# EAGLE design GameController (EAGLE 9.4.2)

## Sheet 1 of 3
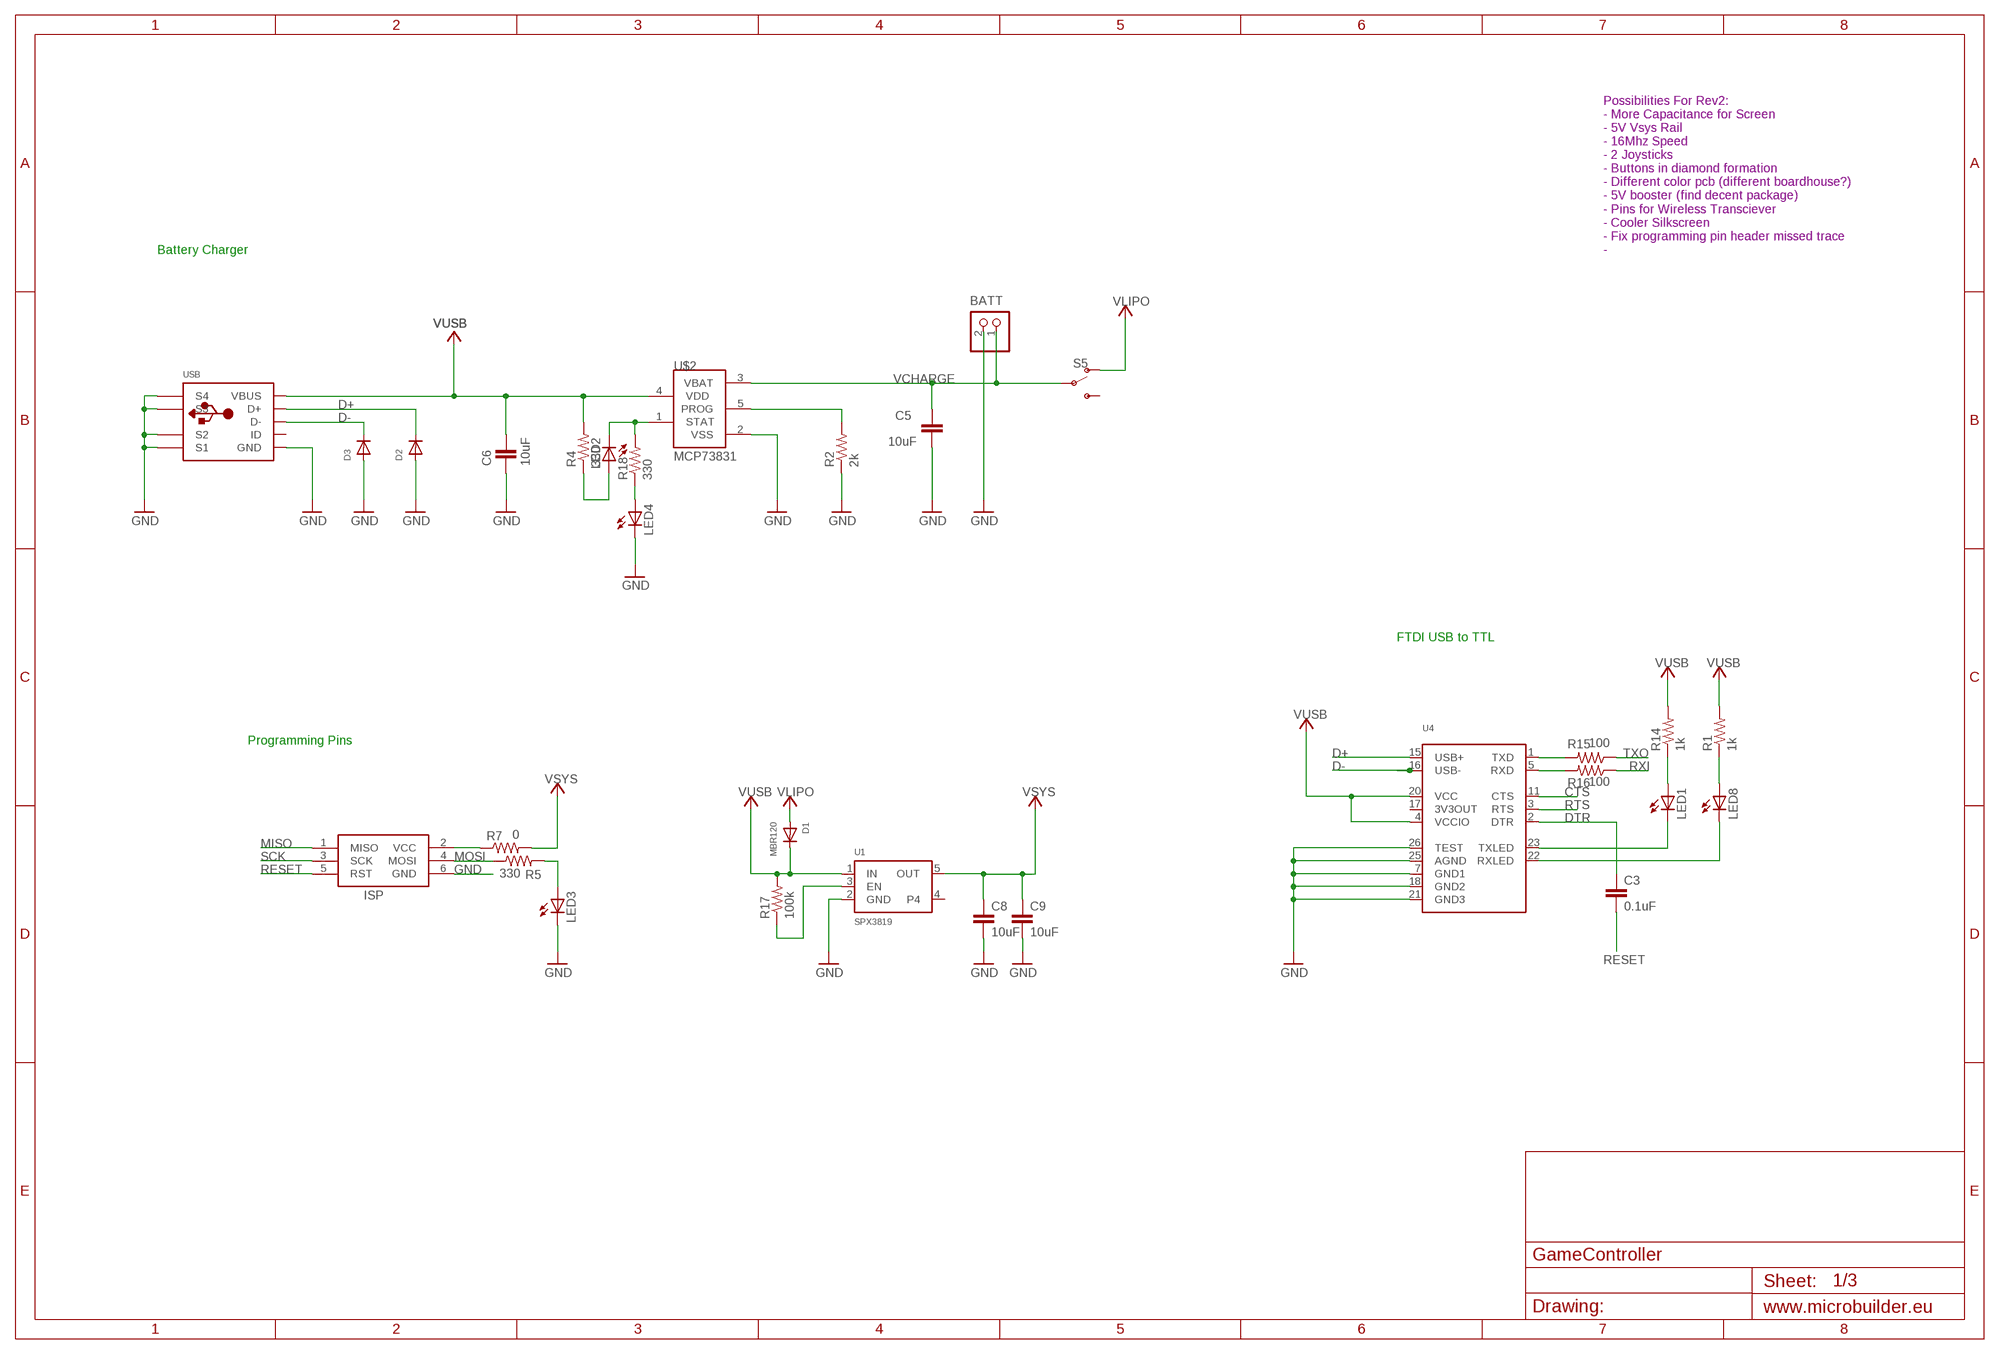
[diagram p0: schematic, sheet 1]

### Parts
BATT  JST_2PIN-SMT-RA  [JST-PH-2-SMT-RA]
C3  0.1uF  C-EUC0805  [C0805]
C5  10uF  C-EUC0805  [C0805]
C6  10uF  C-EUC0805  [C0805]
C8  10uF  C-EUC0805  [C0805]
C9  10uF  C-EUC0805  [C0805]
D1  MBR120  DIODESOD-123  [SOD-123]
D2  DIODESOD-323  [SOD-323]
D3  DIODESOD-323  [SOD-323]
ISP  AVRISP-6  [AVRISP]
LED1  LEDCHIPLED_0805  [CHIPLED_0805]
LED2  LEDCHIPLED_0805  [CHIPLED_0805]
LED3  LEDCHIPLED_0805  [CHIPLED_0805]
LED4  LEDCHIPLED_0805  [CHIPLED_0805]
LED8  LEDCHIPLED_0805  [CHIPLED_0805]
R1  1k  R-US_R0805  [R0805]
R2  2k  R-US_R0805  [R0805]
R4  330  R-US_R0805  [R0805]
R5  330  R-US_R0805  [R0805]
R7  0  R-US_R0805  [R0805]
R14  1k  R-US_R0805  [R0805]
R15  100  R-US_R0805  [R0805]
R16  100  R-US_R0805  [R0805]
R17  100k  R-US_R0805  [R0805]
R18  330  R-US_R0805  [R0805]
S5  SWITCH-SPDT-SMD-RIGHT-ANGLE  [SWITCH_SPST_SMD_A]
U1  SPX3819  VREG_SOT23-5  [SOT23-5]
U4  FT232RLSSOP28  [SSOP28DB]
U$2  MCP73831  [SOT23-5L]
USB  USBMINIB  [USB-MINIB]

### Nets
CTS: U4.11(CTS)
D+: D2.C U4.15(USB+) USB.D+
D-: D3.C U4.16(USB-) USB.D-
DTR: C3.1 U4.2(DTR)
GND: BATT.2 C5.2 C6.2 C8.2 C9.2 D2.A D3.A ISP.6(GND) LED3.C LED4.C R2.1 U1.2(GND) U4.7(GND1) U4.18(GND2) U4.21(GND3) U4.25(AGND) U4.26(TEST) U$2.2(VSS) USB.GND USB.GND1(S1) USB.GND2(S2) USB.GND3(S3) USB.GND4(S4) ; also sheet 2,3
MISO: ISP.1(MISO) ; also sheet 3
MOSI: ISP.4(MOSI) R5.1 ; also sheet 3
N$2: LED3.A R5.2
N$3: LED2.A R4.1
N$4: R15.2 U4.1(TXD)
N$6: LED2.C R18.2 U$2.1(STAT)
N$7: R2.2 U$2.5(PROG)
N$8: R16.2 U4.5(RXD)
N$10: ISP.2(VCC) R7.1
N$11: LED4.A R18.1
N$14: R17.1 U1.3(EN)
N$20: LED1.C U4.23(TXLED)
N$21: LED8.C U4.22(RXLED)
N$22: LED1.A R14.1
N$23: LED8.A R1.1
RESET: C3.2 ISP.5(RST) ; also sheet 3
RTS: U4.3(RTS)
RXI: R16.1 ; also sheet 3
SCK: ISP.3(SCK) ; also sheet 3
TXO: R15.1 ; also sheet 3
VCHARGE: BATT.1 C5.1 S5.2(P) U$2.3(VBAT)
VLIPO: D1.A S5.1(O) ; supply symbol labelled VCC
VSYS: C8.1 C9.1 R7.2 U1.5(OUT) ; supply symbol labelled VCC ; also sheet 2,3
VUSB: C6.1 D1.C R1.2 R4.2 R14.2 R17.2 U1.1(IN) U4.4(VCCIO) U4.20(VCC) U$2.4(VDD) USB.VBUS ; supply symbol labelled VCC
Unconnected: S5.3(S) U1.4 USB.ID

### Notes on the sheet
- Battery Charger
- Possibilities For Rev2:
  - More Capacitance for Screen
  - 5V Vsys Rail
  - 16Mhz Speed
  - 2 Joysticks
  - Buttons in diamond formation
  - Different color pcb (different boardhouse?)
  - 5V booster (find decent package)
  - Pins for Wireless Transciever
  - Cooler Silkscreen
  - Fix programming pin header missed trace
  -
- FTDI USB to TTL
- Programming Pins

## Sheet 2 of 3
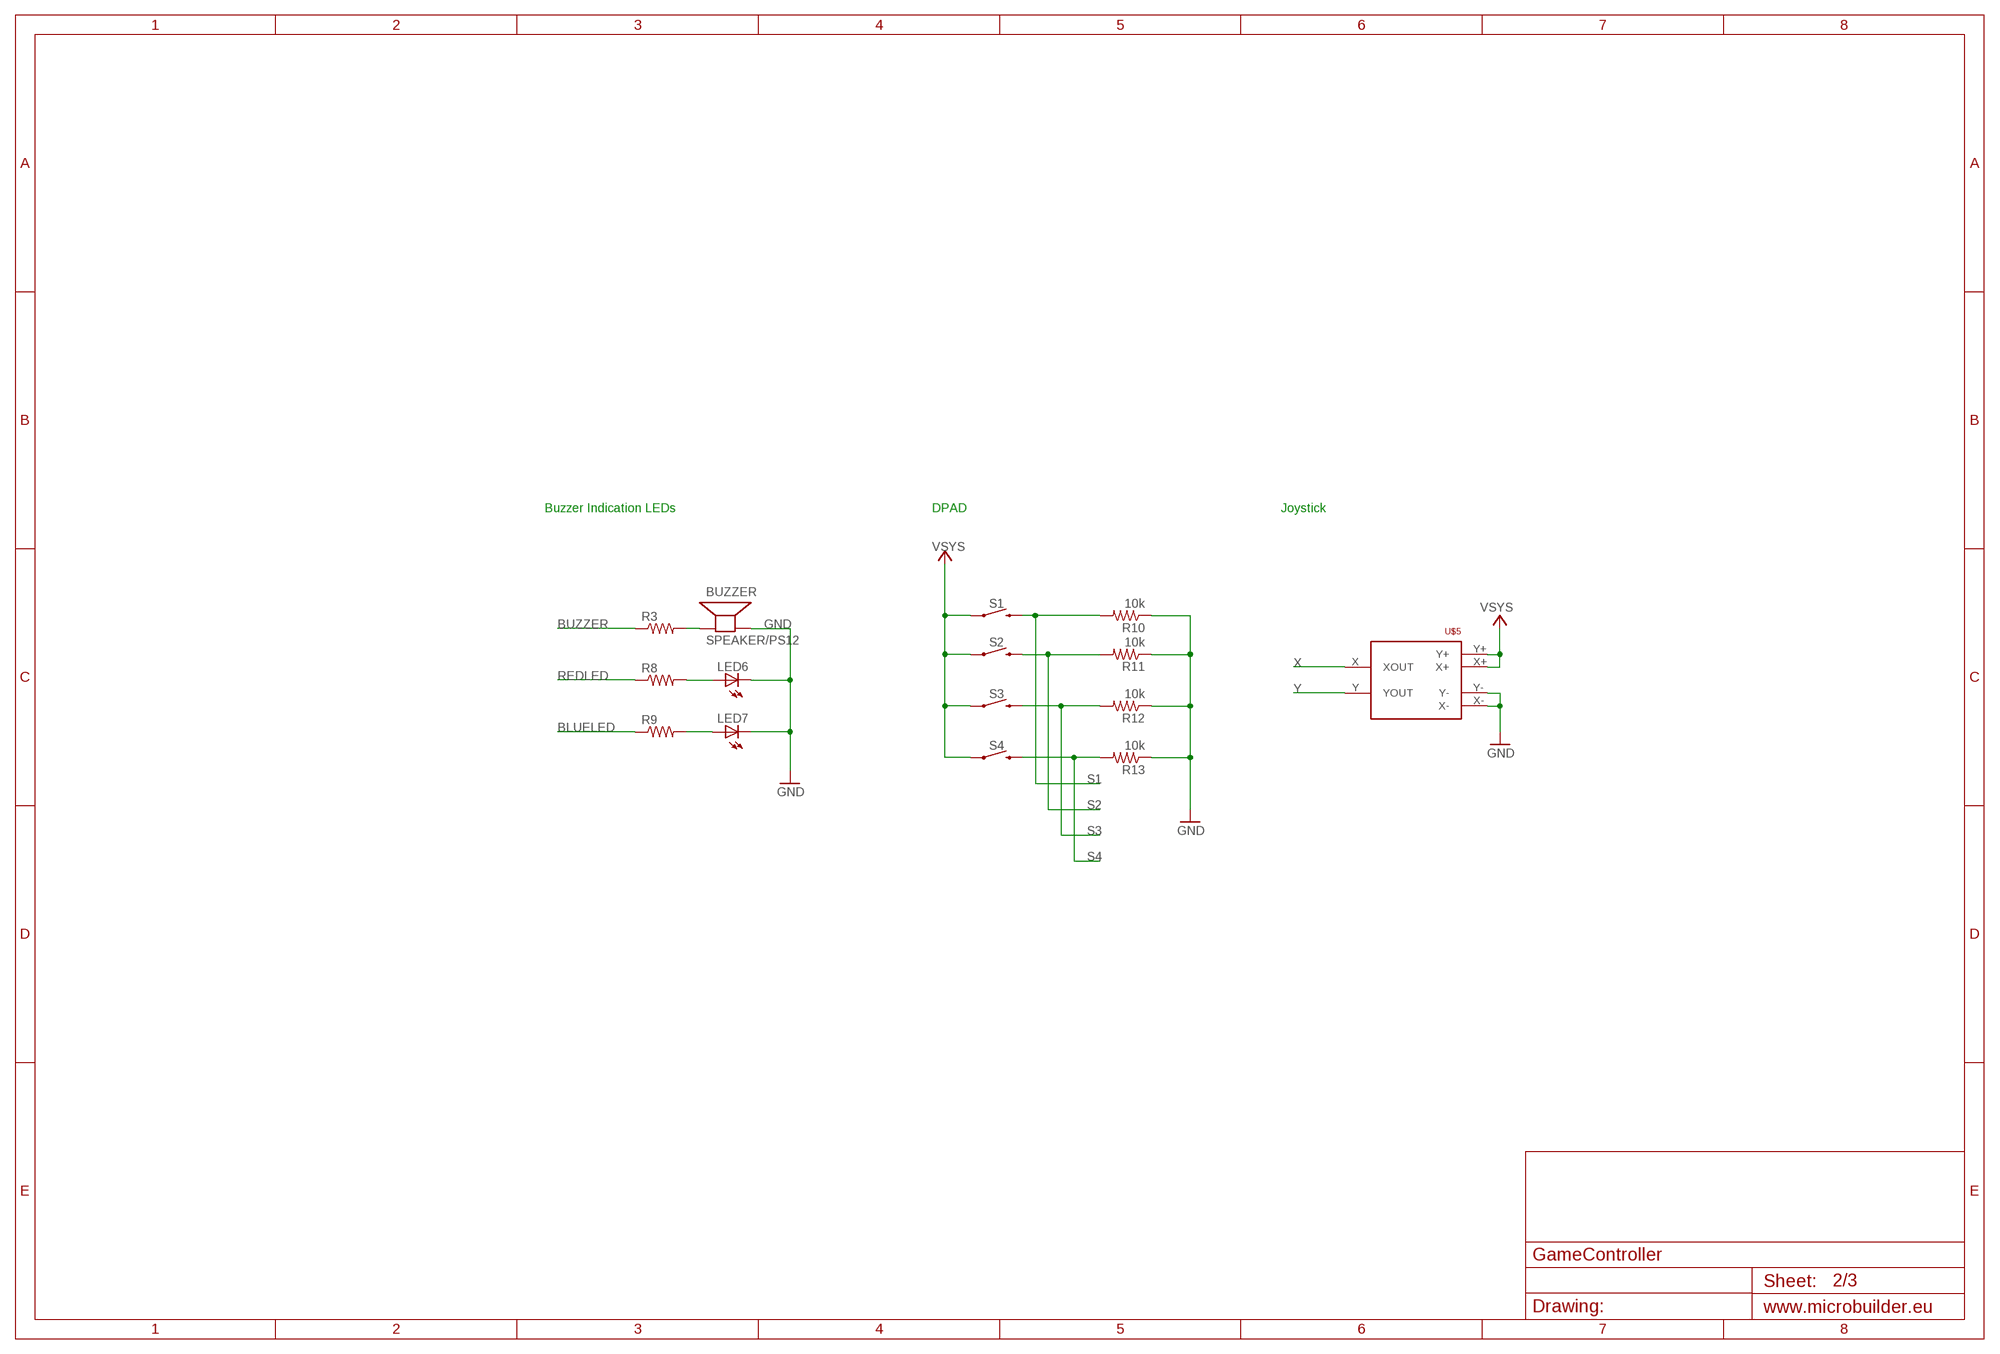
[diagram p1: schematic, sheet 2]

### Parts
BUZZER  SPEAKER/PS12  [PS12]
LED6  LEDCHIPLED_0805  [CHIPLED_0805]
LED7  LEDCHIPLED_0805  [CHIPLED_0805]
R3  R-US_R0805  [R0805]
R8  R-US_R0805  [R0805]
R9  R-US_R0805  [R0805]
R10  10k  R-US_R0805  [R0805]
R11  10k  R-US_R0805  [R0805]
R12  10k  R-US_R0805  [R0805]
R13  10k  R-US_R0805  [R0805]
S1  MOMENTARY-SWITCH-SPST-PTH-6.0MM-KIT  [TACTILE_SWITCH_PTH_6.0MM_KIT]
S2  MOMENTARY-SWITCH-SPST-PTH-6.0MM-KIT  [TACTILE_SWITCH_PTH_6.0MM_KIT]
S3  MOMENTARY-SWITCH-SPST-PTH-6.0MM-KIT  [TACTILE_SWITCH_PTH_6.0MM_KIT]
S4  MOMENTARY-SWITCH-SPST-PTH-6.0MM-KIT  [TACTILE_SWITCH_PTH_6.0MM_KIT]
U$5  JOYSTICK_ANALOG  [JOYSTICK_ANALOG]

### Nets
BLUELED: R9.1 ; also sheet 3
BUZZER: R3.1 ; also sheet 3
GND: BUZZER.P$2(-) LED6.C LED7.C R10.1 R11.1 R12.1 R13.1 U$5.X- U$5.Y- ; also sheet 1,3
N$1: BUZZER.P$1(+) R3.2
N$5: LED6.A R8.2
N$13: LED7.A R9.2
REDLED: R8.1 ; also sheet 3
S1: R10.2 S1.3 ; also sheet 3
S2: R11.2 S2.3 ; also sheet 3
S3: R12.2 S3.3 ; also sheet 3
S4: R13.2 S4.3 ; also sheet 3
VSYS: S1.1 S2.1 S3.1 S4.1 U$5.X+ U$5.Y+ ; supply symbol labelled VCC, 3V3 ; also sheet 1,3
X: U$5.X(XOUT) ; also sheet 3
Y: U$5.Y(YOUT) ; also sheet 3

### Notes on the sheet
- Buzzer Indication LEDs | DPAD | Joystick

## Sheet 3 of 3
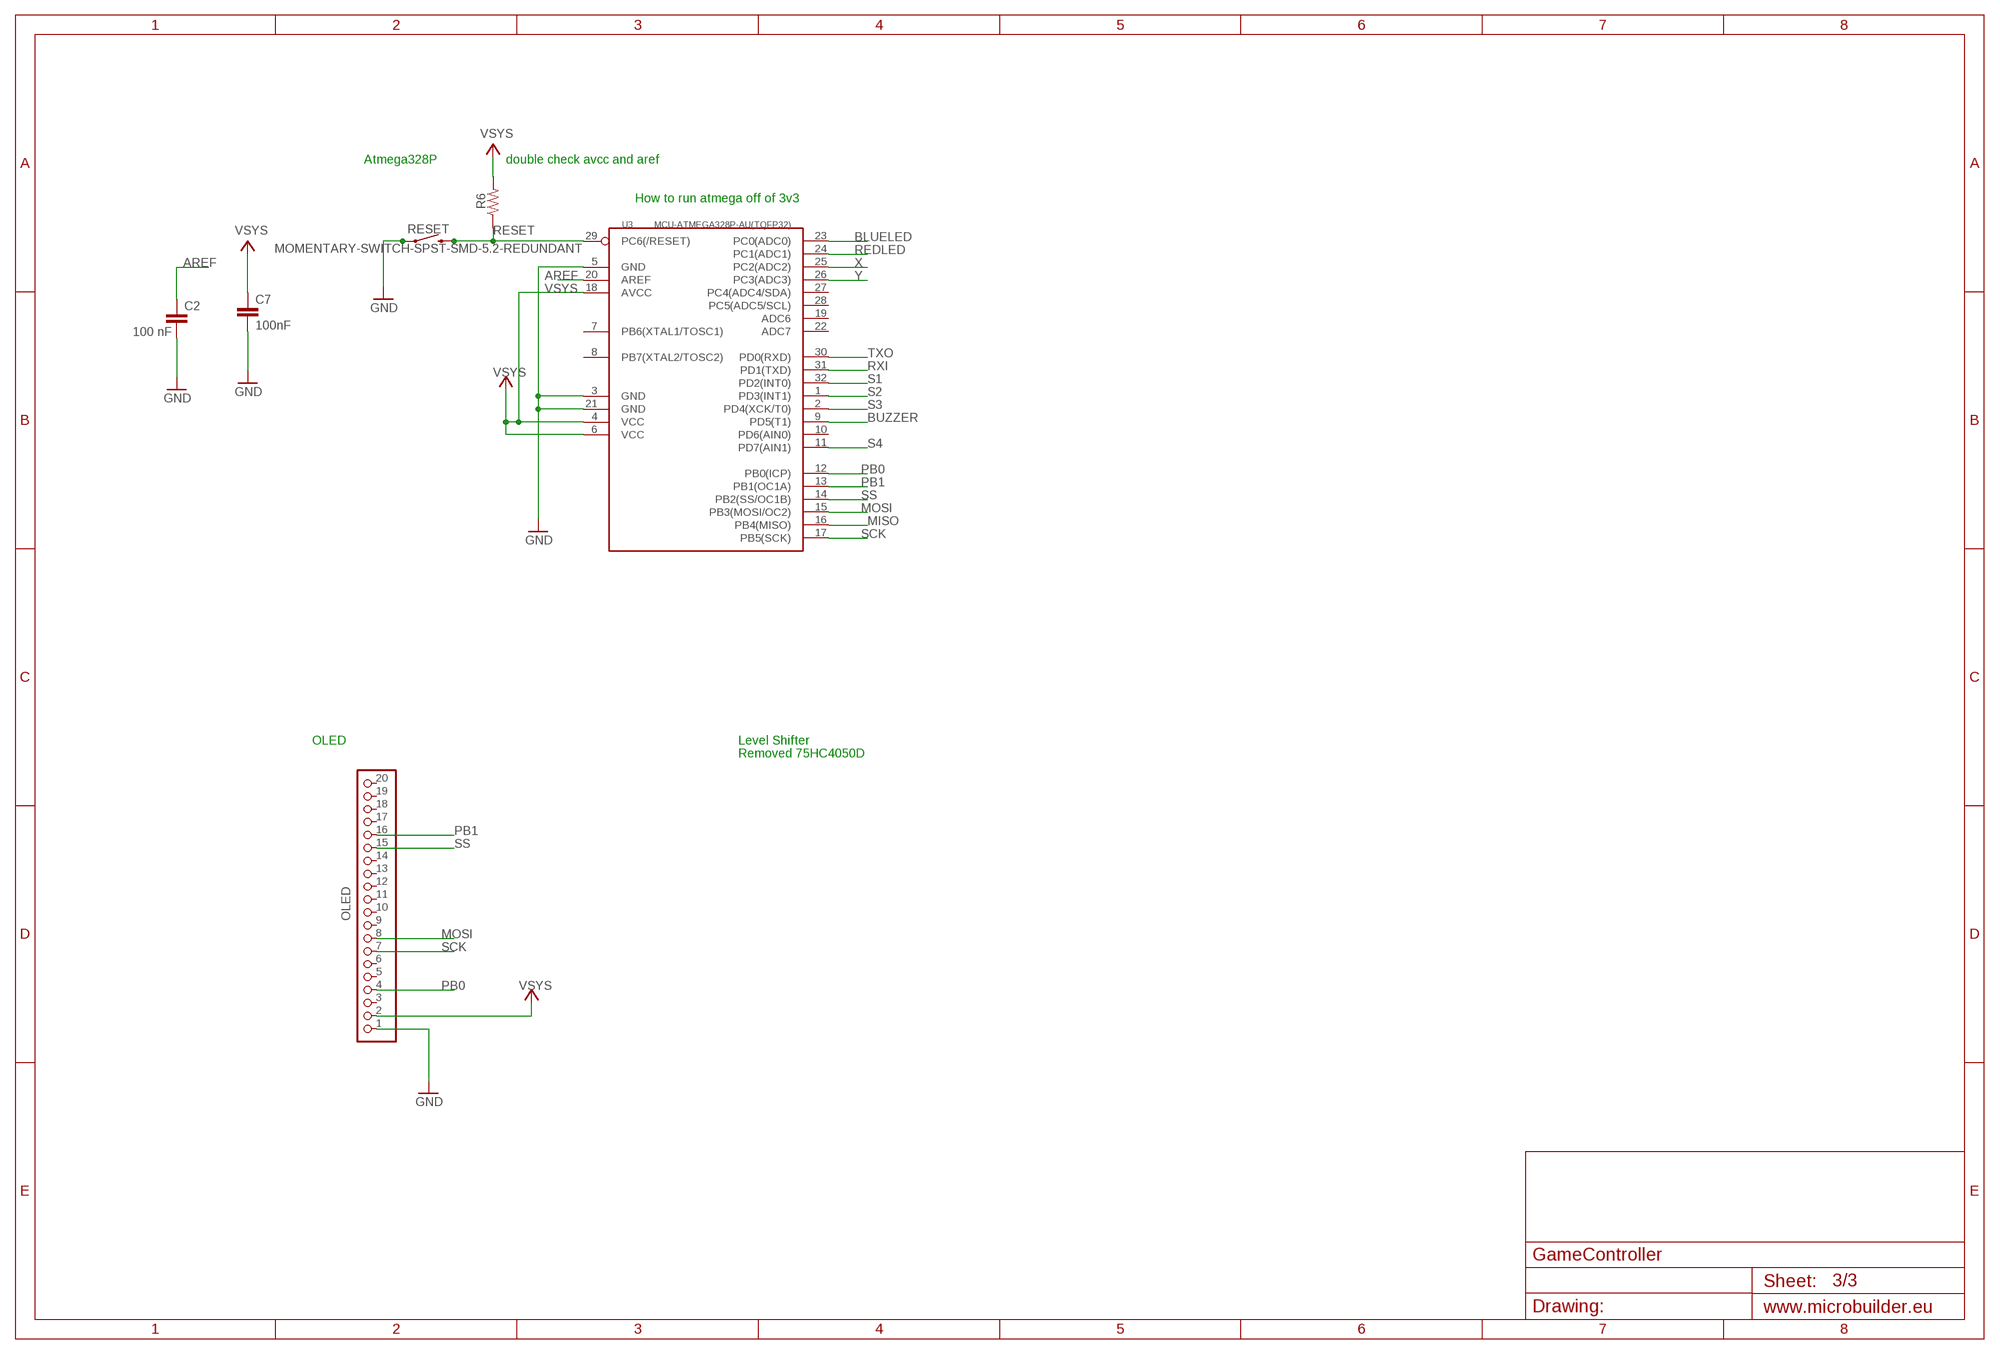
[diagram p2: schematic, sheet 3]

### Parts
C2  100 nF  C-EUC0805  [C0805]
C7  100nF  C-EUC0805  [C0805]
OLED  PINHD-1X20-BIG  [1X20-BIG]
R6  R-US_R0805  [R0805]
RESET  MOMENTARY-SWITCH-SPST-SMD-5.2-REDUNDANT  [TACTILE_SWITCH_SMD_5.2MM]
U3  MCU-ATMEGA328P-AU(TQFP32)  [TQFP32-0.8-7X7MM]

### Nets
AREF: C2.1 U3.20(AREF)
BLUELED: U3.23(PC0(ADC0)) ; also sheet 2
BUZZER: U3.9(PD5(T1)) ; also sheet 2
GND: C2.2 C7.2 OLED.1 RESET.1 RESET.2 U3.3(GND) U3.5(GND) U3.21(GND) ; also sheet 1,2
MISO: U3.16(PB4(MISO)) ; also sheet 1
MOSI: OLED.8 U3.15(PB3(MOSI/OC2)) ; also sheet 1
PB0: OLED.4 U3.12(PB0(ICP))
PB1: OLED.16 U3.13(PB1(OC1A))
REDLED: U3.24(PC1(ADC1)) ; also sheet 2
RESET: R6.1 RESET.3 RESET.4 U3.29(PC6(/RESET)) ; also sheet 1
RXI: U3.31(PD1(TXD)) ; also sheet 1
S1: U3.32(PD2(INT0)) ; also sheet 2
S2: U3.1(PD3(INT1)) ; also sheet 2
S3: U3.2(PD4(XCK/T0)) ; also sheet 2
S4: U3.11(PD7(AIN1)) ; also sheet 2
SCK: OLED.7 U3.17(PB5(SCK)) ; also sheet 1
SS: OLED.15 U3.14(PB2(SS/OC1B))
TXO: U3.30(PD0(RXD)) ; also sheet 1
VSYS: C7.1 OLED.2 R6.2 U3.4(VCC) U3.6(VCC) U3.18(AVCC) ; supply symbol labelled VCC ; also sheet 1,2
X: U3.25(PC2(ADC2)) ; also sheet 2
Y: U3.26(PC3(ADC3)) ; also sheet 2
Unconnected: OLED.3 OLED.5 OLED.6 OLED.9 OLED.10 OLED.11 OLED.12 OLED.13 OLED.14 OLED.17 OLED.18 OLED.19 OLED.20 U3.7(PB6(XTAL1/TOSC1)) U3.8(PB7(XTAL2/TOSC2)) U3.10(PD6(AIN0)) U3.19(ADC6) U3.22(ADC7) U3.27(PC4(ADC4/SDA)) U3.28(PC5(ADC5/SCL))

### Notes on the sheet
- Atmega328P | double check avcc and aref
- How to run atmega off of 3v3
- OLED | Level Shifter
- Removed 75HC4050D

## Power pins joined to a net without a drawn wire
3V3OUT: U4.17(3V3OUT)

## Library data of the parts
BATT = adafruit:JST_2PIN: JST 2-Pin Connectors of various flavors SMT-RA (S2B-PH-SM4) 4UConnector #17311 SMT (B2B-PH-SM4) THM-RA (S2B-PH) THM (B2B-PH)
BUZZER = adafruit:SPEAKER: SPEAKER Source: Buerklin Added PS12 (for part # PS1240 piezo) http://www.ladyada.net/library/pcb/eaglelibrary.html
C2 C5-C7 = rcl:C-EU: CAPACITOR, European symbol; SPICEPREFIX: C
C3 C8 C9 = resistor:C-EU: CAPACITOR, European symbol
D1-D3 = microbuilder:DIODE: Diode SMA Model Volts Amps Type Vf Vr Digikey # Notes SSA34-E3 40V 3A Schottky 480mV @ 3A 200uA @ 40V SSA34-E3/61TGITR-ND CDBA120-G 20V 1A Schottky 500mV @ 1A 500uA @ 20V 641-1014-6-ND REEL MBRA210 10V 2A Schottky 350mV @ 2A 700uA @ 10V MBRA210LT3 SOD-123 Model Volts Amps Type Vf Vr Order # Notes BAT54T1G 30V 200mA Schottky 800mV @ 200mA 2uA @ 25V BAT54T1GOSTR-ND B0530W 30V 500mA Schottky 430mV @ 500mA 130uA @ 30V B0530W-FDICT-ND REEL MBR120 1A 20V Schottky 340mV @ 1A MBR120VLSFT1GOSCT-ND SOD-323 Model Volts Amps Type Vf Vr Order # Notes PMEG2005EJ 20V 500mA Schottky 355mV @ 500mA 568-4110-1-ND ZLLS410 10V 570mA Schottky 380mV @ 570mA ZLLS410CT-ND 1N4148WS 75V 150mA Silicon/Simple 1V 1N4148WSFSCT-ND REEL SOD-523 Model Volts Amps Type Vf Vr Order # Notes BAT54XV2 30V 200mA Schottky 0.8V @ 100mA BAT54XV2CT-ND TB751S 30V 30mA Schottky RB751S-40TE61CT-ND SOT23-R/W (R = Solder Paste/Reflow Ovens, W = Hand-Soldering) Model Volts Amps Type Vf Vr Order # Notes BAT54FILM 40V 300mA Schottky 497-7162-1-ND
ISP = adafruit:AVRISP: AVR ISP HEADER Standard 6 pin header for AVR programming
LED1-LED4 LED6-LED8 = led:LED: LED OSRAM: - CHIPLED LG R971, LG N971, LY N971, LG Q971, LY Q971, LO R971, LY R971 LH N974, LH R974 LS Q976, LO Q976, LY Q976 LO Q996 - Hyper CHIPLED LW Q18S LB Q993, LB Q99A, LB R99A - SideLED LS A670, LO A670, LY A670, LG A670, LP A670 LB A673, LV A673, LT A673, LW A673 LH A674 LY A675 LS A676, LA A676, LO A676, LY A676, LW A676 LS A679, LY A679, LG A679 - Hyper Micro SIDELED® LS Y876, LA Y876, LO Y876, LY Y876 LT Y87S - SmartLED LW L88C, LW L88S LB L89C, LB L89S, LG L890 LS L89K, LO L89K, LY L89K LS L896, LA L896, LO L896, LY L896 - TOPLED LS T670, LO T670, LY T670, LG T670, LP T670 LSG T670, LSP T670, LSY T670, LOP T670, LYG T670 LG T671, LOG T671, LSG T671 LB T673, LV T673, LT T673, LW T673 LH T674 LS T676, LA T676, LO T676, LY T676, LB T676, LH T676, LSB T676, LW T676 LB T67C, LV T67C, LT T67C, LS T67K, LO T67K, LY T67K, LW E67C LS E67B, LA E67B, LO E67B, LY E67B, LB E67C, LV E67C, LT E67C LW T67C LS T679, LY T679, LG T679 LS T770, LO T770, LY T770, LG T770, LP T770 LB T773, LV T773, LT T773, LW T773 LH T774 LS E675, LA E675, LY E675, LS T675 LS T776, LA T776, LO T776, LY T776, LB T776 LHGB T686 LT T68C, LB T68C - Hyper Mini TOPLED® LB M676 - Mini TOPLED Santana® LG M470 LS M47K, LO M47K, LY M47K Source: http://www.osram.convergy.de LUXEON: - LUMILED® LXK2-PW12-R00, LXK2-PW12-S00, LXK2-PW14-U00, LXK2-PW14-V00 LXK2-PM12-R00, LXK2-PM12-S00, LXK2-PM14-U00 LXK2-PE12-Q00, LXK2-PE12-R00, LXK2-PE12-S00, LXK2-PE14-T00, LXK2-PE14-U00 LXK2-PB12-K00, LXK2-PB12-L00, LXK2-PB12-M00, LXK2-PB14-N00, LXK2-PB14-P00, LXK2-PB14-Q00 LXK2-PR12-L00, LXK2-PR12-M00, LXK2-PR14-Q00, LXK2-PR14-R00 LXK2-PD12-Q00, LXK2-PD12-R00, LXK2-PD12-S00 LXK2-PH12-R00, LXK2-PH12-S00 LXK2-PL12-P00, LXK2-PL12-Q00, LXK2-PL12-R00 Source: www.luxeon.com KINGBRIGHT: KA-3528ASYC Source: www.kingbright.com
OLED = adafruit:PINHD-1X20: PIN HEADER
R1-R18 = resistor:R-US_: RESISTOR, American symbol
RESET = SparkFun-Switches:MOMENTARY-SWITCH-SPST: Momentary Switch (Pushbutton) - SPST Normally-open (NO) SPST momentary switches (buttons, pushbuttons). Variants PTH-12MM - 12mm square, through-hole Momentary Pushbutton Switch - 12mm Square <https://www.sparkfun.com/products/9190> (COM-09190) PTH-6.0MM, PTH-6.0MM-KIT - 6.0mm square, through-hole Mini Pushbutton Switch <https://www.sparkfun.com/products/97> (COM-00097) KIT package intended for soldering kit's - only one side of pads' copper is exposed. PTH-RIGHT-ANGLE-KIT - Right-angle, through-hole Right Angle Tactile Button <https://www.sparkfun.com/products/10791> - Used on SparkFun BigTime Watch Kit <https://www.sparkfun.com/products/11734> SMD-12MM - 12mm square, surface-mount Tactile Button - SMD (12mm) <https://www.sparkfun.com/products/12993> (COM-12993) Used on SparkFun PicoBoard <https://www.sparkfun.com/products/11888> SMD-4.5MM - 4.5mm Square Trackball Switch Used on SparkFun Blackberry Trackballer Breakout <https://www.sparkfun.com/products/13169> SMD-4.6MMX2.8MM - 4.60mm x 2.80mm, surface mount Used on SparkFun SAMD21 Mini Breakout <https://www.sparkfun.com/products/13664> SMD-5.2MM, SMD-5.2-REDUNDANT - 5.2mm square, surface-mount Mini Pushbutton Switch - SMD <https://www.sparkfun.com/products/8720> (COM-08720) Used on Arduino Pro Mini <https://www.sparkfun.com/products/11114> REDUNDANT package connects both switch circuits together SMD-6.0X3.5MM - 6.0 x 3.5mm, surface mount Momentary Reset Switch SMD <https://www.sparkfun.com/products/8229> (COM-08229) SMD-6.2MM-TALL - 6.2mm square, surface mount Tactile Button - SMD (6mm) <https://www.sparkfun.com/products/12992> Used on SparkFun Digital Sandbox <https://www.sparkfun.com/products/12651> SMD-RIGHT-ANGLE - Right-angle, surface mount Used on SparkFun Block for Intel® Edison - Arduino <https://www.sparkfun.com/products/13036>; PROD_ID: SWCH-08247; SF_SKU: COM-08720
S1-S4 = SparkFun-Switches:MOMENTARY-SWITCH-SPST: Momentary Switch (Pushbutton) - SPST Normally-open (NO) SPST momentary switches (buttons, pushbuttons). Variants PTH-12MM - 12mm square, through-hole Momentary Pushbutton Switch - 12mm Square <https://www.sparkfun.com/products/9190> (COM-09190) PTH-6.0MM, PTH-6.0MM-KIT - 6.0mm square, through-hole Mini Pushbutton Switch <https://www.sparkfun.com/products/97> (COM-00097) KIT package intended for soldering kit's - only one side of pads' copper is exposed. PTH-RIGHT-ANGLE-KIT - Right-angle, through-hole Right Angle Tactile Button <https://www.sparkfun.com/products/10791> - Used on SparkFun BigTime Watch Kit <https://www.sparkfun.com/products/11734> SMD-12MM - 12mm square, surface-mount Tactile Button - SMD (12mm) <https://www.sparkfun.com/products/12993> (COM-12993) Used on SparkFun PicoBoard <https://www.sparkfun.com/products/11888> SMD-4.5MM - 4.5mm Square Trackball Switch Used on SparkFun Blackberry Trackballer Breakout <https://www.sparkfun.com/products/13169> SMD-4.6MMX2.8MM - 4.60mm x 2.80mm, surface mount Used on SparkFun SAMD21 Mini Breakout <https://www.sparkfun.com/products/13664> SMD-5.2MM, SMD-5.2-REDUNDANT - 5.2mm square, surface-mount Mini Pushbutton Switch - SMD <https://www.sparkfun.com/products/8720> (COM-08720) Used on Arduino Pro Mini <https://www.sparkfun.com/products/11114> REDUNDANT package connects both switch circuits together SMD-6.0X3.5MM - 6.0 x 3.5mm, surface mount Momentary Reset Switch SMD <https://www.sparkfun.com/products/8229> (COM-08229) SMD-6.2MM-TALL - 6.2mm square, surface mount Tactile Button - SMD (6mm) <https://www.sparkfun.com/products/12992> Used on SparkFun Digital Sandbox <https://www.sparkfun.com/products/12651> SMD-RIGHT-ANGLE - Right-angle, surface mount Used on SparkFun Block for Intel® Edison - Arduino <https://www.sparkfun.com/products/13036>; PROD_ID: SWCH-08441; SF_SKU: COM-00097
S5 = SparkFun-Switches:SWITCH-SPDT: Single Pole, Double Throw (SPDT) Switch Single-pole, double-throw (SPDT) switch. Variant Overview SMD-AYZ0202 Surface Mount DPDT Switch <https://www.sparkfun.com/products/597> (COM-00597) Used on e.g. LilyPad Arduino USB - ATmega32U4 Board <https://www.sparkfun.com/products/12049> PTH-11.6X4.0MM SPDT Mini Power Switch <https://www.sparkfun.com/products/102> (COM-00102) Used on e.g. SparkFun Simon Says - Through-Hole Soldering Kit <https://www.sparkfun.com/products/10547> (KIT-10547) PTH-11.6X4.0MM-KIT KIT version of SPDT Mini Power Switch - Simplifies soldering by removing tStop of switch pins - only one side can be soldered. PTH-11.6X4.0MM-LOCK LOCK version of SPDT Mini Power Switch - Offset pins hold switch in place for easier soldering. SMD-RIGHT-ANGLE Surface Mount Right Angle Switch <https://www.sparkfun.com/products/10860> (COM-10860) Used on e.g. SparkFun ESP8266 Thing <https://www.sparkfun.com/products/13231>; PROD_ID: SWCH-10651; SF_SKU: COM-10860
U1 = microbuilder:VREG_SOT23-5: SOT23-5 Fixed Voltage Regulators To better organise some of the SOT23-5 fixed voltage regulators in this library, this new part was created. Part Current Out V Out V In V Dropout Digikey Part No. ADP121 150mA 3.3V 3.4-5.5V 0.09V @ 150mA ADP121-AUJZ33R7CT-ND ADP121 150mA 3.0V 3.1-5.5V 0.09V @ 150mA ADP121-AUJZ30R7CT-ND ADP122 300mA 3.3V 3.4-5.5V 0.085V @ 300mA ADP122AUJZ-3.3-R7CT-ND ADP1712 300mA 3.3V 3.5-5.5V 0.17V @ 300mA ADP1712AUJZ-3.3-R7TR-ND AP7311 (Low Cost) 150mA 3.3V 3.5-6V 0.15V @ 150mA AP7311-33WG-7DICT-ND LD39015M18R 150mA 1.8V 1.9V-5.5V 0.08V @ 100mA 497-6977-1-ND MCP1824T-3302E/OT 300mA 3.3V 3.5V-6V 0.2V @ 300mA MCP1824T-3302E/OTCT-ND MIC5205-2.5YM5 TR 150mA 2.5V 2.7-16V 0.165V @ 150mA 576-1257-2-ND MIC5205-3.0YM5 TR 150mA 3.0V 3.2V-16V 0.165V @ 150mA 576-1258-2-ND MIC5205-3.3YM5 TR 150mA 3.3V 3.5V-16V 0.165V @ 150mA 576-1259-2-ND TPS780330220 150mA 3.3V+2.2V 3.6-5.5V 250mV Max 296-23332-1-ND TDA3663/N1,135 100mA 3.3V 3.5-45V 0.18V @ 50mA 568-5343-1-ND
U3 = MCU-ATMEGA328P-AU_TQFP32_:MCU-ATMEGA328P-AU(TQFP32): 310010049; DESCRIPTION: Microcontroller Mcu, 8 Bit, Atmega, 20mhz, Tqfp-32; DIGI-KEY_PART_NUMBER: ATMEGA328P-AU-ND; DIGI-KEY_PURCHASE_URL: https://www.digikey.com/product-detail/en/microchip-technology/ATMEGA328P-AU/ATMEGA328P-AU-ND/1832260?utm_source=snapeda&utm_medium=aggregator&utm_campaign=symbol; MF: Microchip; MP: ATMEGA328P-AU; PACKAGE: TQFP-32 Microchip
U4 = microbuilder:FT232RL: FTDI FT232RL USB TO RS232 Converter Digikey: 768-1007-1-ND
U$2 = mcp73831:MCP73831: Miniature Single-Cell, Fully Integrated Li-Ion, Li-Polymer Charge Management Controllers
U$5 = Nick's Personal Part:JOYSTICK_ANALOG
USB = microbuilder:USB: USB Connectors USBMINIB - Surface Mount Female Mini-B USB Connector 4UConnector: 06564

## Board
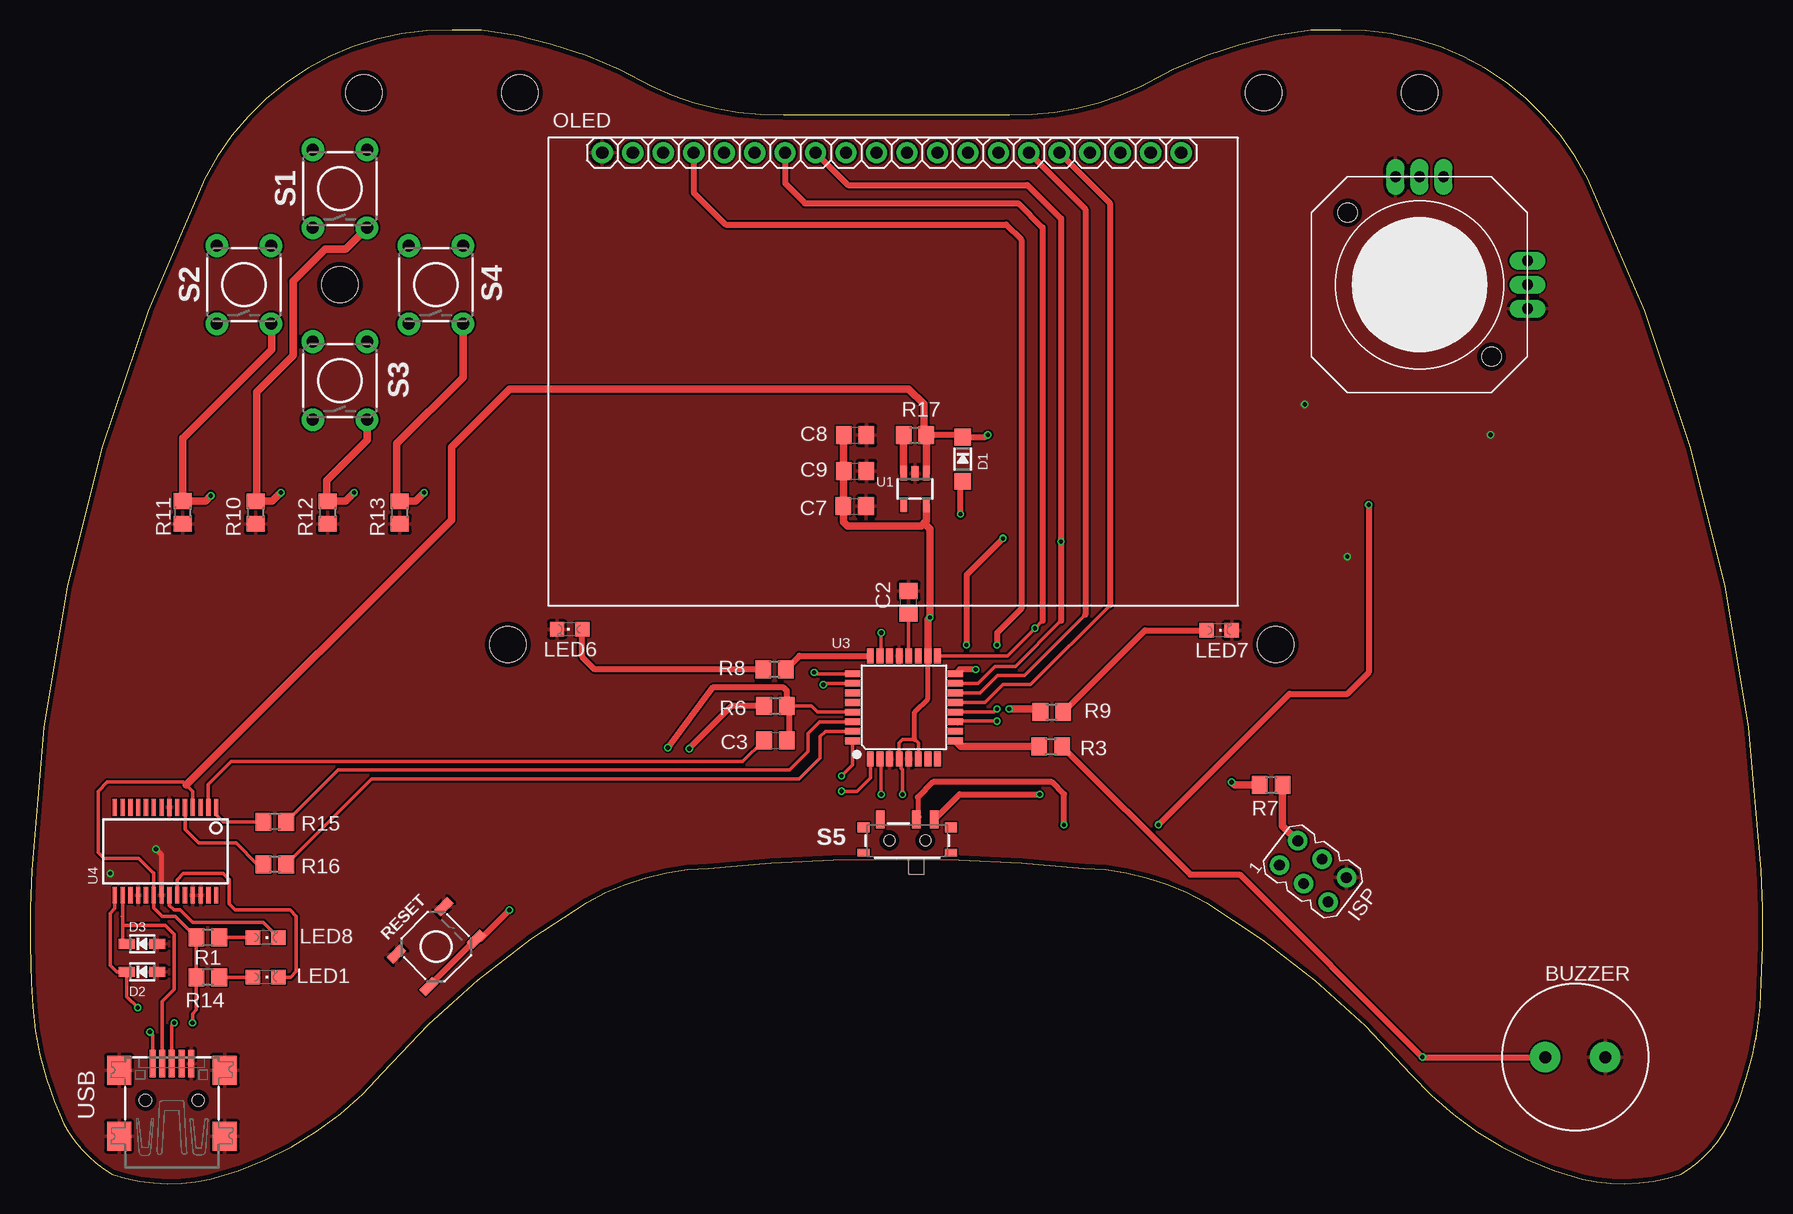
[diagram p3: board, top side]
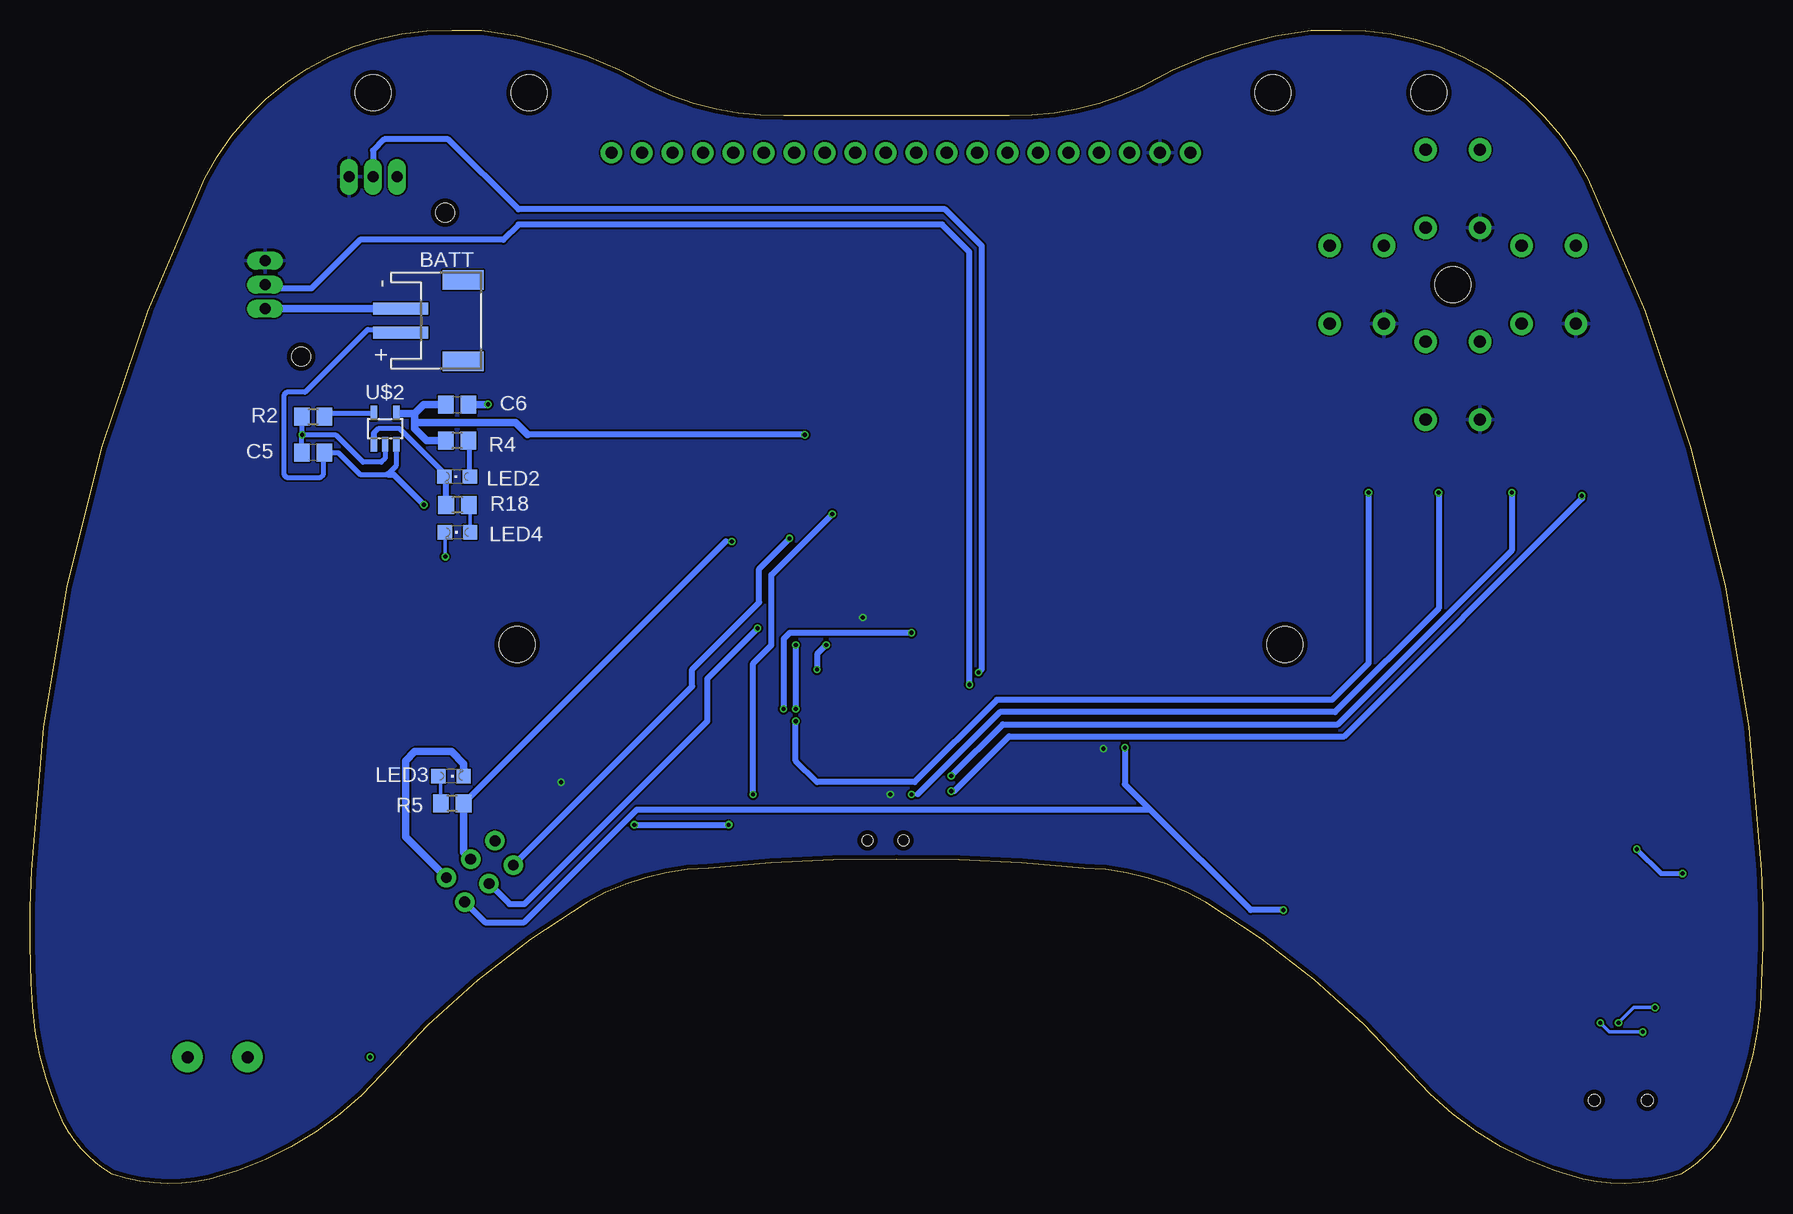
[diagram p4: board, bottom side, seen from below]

Size 144.43 x 96.17 mm. Coordinates in mm from the lower left corner, seen from the top.
Outline: 143.89,12.03 arc0 143.94,12.45
Outline: 2.81,4.98 arc30 6.84,0.76 arc31 14.99,0.37 arc35 29.41,9.22 arc-18 46.42,23.44 arc-29 56.56,26.29 arc-6 72.22,27.04 arc-6 87.87,26.29 arc-29 98.01,23.44 arc-18 115.12,9.12 arc34 129.44,0.37 arc31 137.6,0.76 arc30 141.62,4.98 arc25 144.32,16.75 arc7 144.3,26.1 arc23 129.86,83.77 arc64 109.26,96.17 106.79,96.17 arc22 92.6,91.46 arc-27 81.64,89.06 62.8,89.06 arc-27 51.84,91.46 arc22 37.65,96.17 35.17,96.17 arc64 14.57,83.77 arc23 0.14,26.1 arc7 0.12,16.75 arc25 2.81,4.98
Copper layers (1*16): Top 0.035559375mm / dielectric 1.6mm / Bottom 0.035559375mm
Design rules "oshpark-2layer": minimum track width 6mil, minimum drill 10mil, track to track 6mil, track to pad 6mil, pad to pad 6mil, via to via 6mil, smd to smd 6mil, copper to edge 15mil, drill to drill 6mil, minimum pad ring 5mil, minimum via ring 5mil, stop-mask expansion 2.5mil, vias tented up to drill 0mil, thermal gap 10mil
Holes 3 mm at 25.83,74.94 27.83,90.94 40.83,90.94 102.83,90.94 115.83,90.94 39.83,44.94 103.83,44.94

### Footprints (pad centres in the part's own frame; a part is rotated, then mirrored left to right if it is on the bottom)
JST-PH-2-SMT-RA = smd 1 x 4.6: 1 1,-3.7; 2 -1,-3.7 | smd 1.6 x 3.4: NC1 -3.4,1.5; NC2 3.4,1.5
PS12 = drill 1 pad 2.54: P$1 -2.5,0; P$2 2.5,0
C0805 = smd 1.3 x 1.5: 1 -0.95,0; 2 0.95,0
SOD-123 = smd 1.4 x 1.4: A 1.85,0; C -1.85,0
SOD-323 = smd 1.35 x 0.8: A 1.27,0; C -1.27,0
AVRISP = drill 0.9 pad 1.626: 1 -1.27,2.54; 2 1.27,2.54; 3 -1.27,0; 4 1.27,0; 5 -1.27,-2.54; 6 1.27,-2.54
CHIPLED_0805 = smd 1.2 x 1.2: A 0,-1.05; C 0,1.05
1X20-BIG = drill 1.016 pad 1.778: 1 -24.13,0; 2 -21.59,0; 3 -19.05,0; 4 -16.51,0; 5 -13.97,0; 6 -11.43,0; 7 -8.89,0; 8 -6.35,0; 9 -3.81,0; 10 -1.27,0; 11 1.27,0; 12 3.81,0; 13 6.35,0; 14 8.89,0; 15 11.43,0; 16 13.97,0; 17 16.51,0; 18 19.05,0; 19 21.59,0; 20 24.13,0
R0805 = smd 1.3 x 1.5: 1 -0.95,0; 2 0.95,0
TACTILE_SWITCH_SMD_5.2MM = smd 1.524 x 0.762: 1 -2.794,1.905; 2 2.794,1.905; 3 -2.794,-1.905; 4 2.794,-1.905
TACTILE_SWITCH_PTH_6.0MM_KIT = drill 1.016 pad 1.88: 1 -3.251,2.261; 2 3.251,2.261; 3 -3.251,-2.261; 4 3.251,-2.261
SWITCH_SPST_SMD_A = smd 0.7 x 1.5: 1 -2.25,-1.75; 2 -0.75,-1.75; 3 2.25,-1.75 | smd 1 x 0.6: GND1 -3.65,1; GND3 3.65,1 | smd 1 x 0.8: GND2 -3.65,-1.1; GND4 3.65,-1.1 | hole 0.9: -1.5,0; 1.5,0
SOT23-5 = smd 0.55 x 1.2: 1 -0.95,-1.3; 2 0,-1.3; 3 0.95,-1.3; 4 0.95,1.3; 5 -0.95,1.3
TQFP32-0.8-7X7MM = smd 1.27 x 0.559: 1 -4.293,2.8; 2 -4.293,2; 3 -4.293,1.2; 4 -4.293,0.4; 5 -4.293,-0.4; 6 -4.293,-1.2; 7 -4.293,-2; 8 -4.293,-2.8; 17 4.293,-2.8; 18 4.293,-2; 19 4.293,-1.2; 20 4.293,-0.4; 21 4.293,0.4; 22 4.293,1.2; 23 4.293,2; 24 4.293,2.8 | smd 0.559 x 1.27: 9 -2.8,-4.293; 10 -2,-4.293; 11 -1.2,-4.293; 12 -0.4,-4.293; 13 0.4,-4.293; 14 1.2,-4.293; 15 2,-4.293; 16 2.8,-4.293; 25 2.8,4.293; 26 2,4.293; 27 1.2,4.293; 28 0.4,4.293; 29 -0.4,4.293; 30 -1.2,4.293; 31 -2,4.293; 32 -2.8,4.293
SSOP28DB = smd 0.348 x 1.397: 1 -4.225,-3.656; 2 -3.575,-3.656; 3 -2.925,-3.656; 4 -2.275,-3.656; 5 -1.625,-3.656; 6 -0.975,-3.656; 7 -0.325,-3.656; 8 0.325,-3.656; 9 0.975,-3.656; 10 1.625,-3.656; 11 2.275,-3.656; 12 2.925,-3.656; 13 3.575,-3.656; 14 4.225,-3.656; 15 4.225,3.656; 16 3.575,3.656; 17 2.925,3.656; 18 2.275,3.656; 19 1.625,3.656; 20 0.975,3.656; 21 0.325,3.656; 22 -0.325,3.656; 23 -0.975,3.656; 24 -1.625,3.656; 25 -2.275,3.656; 26 -2.925,3.656; 27 -3.575,3.656; 28 -4.225,3.656
SOT23-5L = smd 0.533 x 1.2: 1 -0.95,-1.3; 2 0,-1.3; 3 0.95,-1.3 | smd 0.55 x 1.2: 4 0.95,1.3; 5 -0.95,1.3
JOYSTICK_ANALOG = drill 0.9 pad 1.5 long: X 0,9; X+ 2,9; X- -2,9; Y 9,0; Y+ 9,2; Y- 9,-2 | hole 1.6: -6,6; 6,-6
USB-MINIB = smd 0.5 x 2.308: D+ 0,4.064; D- -0.8,4.064; GND 1.6,4.064; ID 0.8,4.064; VBUS -1.6,4.064 | smd 2 x 2.4: GND1 -4.4,-2; GND2 -4.4,3.5; GND3 4.4,3.5; GND4 4.4,-2 | hole 1: -2.2,1; 2.2,1

### Placement (x,y rotation side)
BATT  109.83,71.94 270 bottom
BUZZER  128.8,10.55 0 top
C2  73.24,48.45 90 top
C3  62.14,36.96 0 top
C5  120.83,60.94 180 bottom
C6  108.83,64.94 0 bottom
C7  68.74,56.47 0 top
C8  68.77,62.4 0 top
C9  68.77,59.41 0 top
D1  77.75,60.4 270 top
D2  9.34,17.65 0 top
D3  9.34,19.99 0 top
ISP  106.94,26.03 53 top
LED1  19.65,17.21 270 top
LED2  108.83,58.94 90 bottom
LED3  109.34,33.98 270 bottom
LED4  108.8,54.3 90 bottom
LED6  44.99,46.21 90 top
LED7  99.13,46.13 270 top
LED8  19.65,20.51 270 top
OLED  71.83,85.94 0 top
R1  14.82,20.51 180 top
R2  120.83,63.94 0 bottom
R3  85.09,36.45 0 top
R4  108.83,61.94 180 bottom
R5  109.24,31.69 180 bottom
R6  62.14,39.8 180 top
R7  103.47,33.21 180 top
R8  62.06,42.87 180 top
R9  85.18,39.31 0 top
R10  18.83,55.94 90 top
R11  12.74,55.95 90 top
R12  24.83,55.94 90 top
R13  30.83,55.94 90 top
R14  14.82,17.21 180 top
R15  20.41,30.17 180 top
R16  20.41,26.61 180 top
R17  73.77,62.4 0 top
R18  108.8,56.58 180 bottom
RESET  33.87,19.75 45 top
S1  25.83,82.94 90 top
S2  17.83,74.94 90 top
S3  25.83,66.94 90 top
S4  33.83,74.94 90 top
S5  73.13,28.59 180 top
U1  73.77,57.9 180 top
U3  72.85,39.7 90 top
U4  11.29,27.7 180 top
U$2  114.83,62.94 0 bottom
U$5  115.83,74.94 0 top
USB  11.83,5.94 0 top

### Tracks (layer width: path | path; a pad name or v marks a point on that pad's centre or on a via)
AREF
  Top 0.305: U3.20 C2.1
BLUELED  (via drill 0.35)
  Top 0.305: U3.23 70.95,44.1 v70.95,45.91 | 83.97,39.56 R9.1
  Top 0.61: 83.97,39.56 v81.62,39.56
  Bottom 0.508: v70.95,45.91 81.11,45.91 81.62,45.41 v81.62,39.56
BUZZER
  Top 0.61: R3.1 77.6,36.45 U3.9
D+  (via drill 0.35)
  Top 0.305: U4.15 7.07,22.92 6.69,22.55 6.69,18.18 7.16,17.72 7.23,17.65 D2.C 8.07,15.58 v8.98,14.67 | USB.D+ 11.83,13.21 v12.03,13.4
  Bottom 0.305: v12.03,13.4 10.76,14.67 v8.98,14.67
D-
  Top 0.305: 7.71,22.29 7.72,22.3 | 7.72,22.3 U4.16 | 7.72,22.3 7.72,21.53 | 7.72,21.53 7.72,20.34 D3.C | USB.D- 11.03,15.2 12.03,16.2 12.03,20.77 11.26,21.53 7.72,21.53
DTR
  Top 0.305: U4.2 14.87,33.26 16.78,35.18 59.41,35.18 C3.1
GND  (via drill 0.35)
  Top 0.406: U4.21 10.97,27.41 v10.5,27.88
  Bottom 0.305: 106.28,64.94 v106.26,64.96 | LED4.C 109.85,52.3 v109.82,52.26
  Bottom 0.406: C5.2 121.78,62.39 | 121.78,62.39 v121.75,62.42 | R2.1 121.78,62.39 | U$2.2 114.83,60.45 115.15,60.14 116.67,60.14 118.93,62.39 121.78,62.39 | v10.5,27.88 8.47,25.85 v6.69,25.85
  Bottom 0.61: BATT.2 U$5.Y- | C6.2 106.28,64.94 | LED3.C 108.29,34.99 109.31,36.01 112.36,36.01 113.12,35.25 113.12,28.9 ISP.6
  pour Top: -5.8,-0.91 -9.34,100.41 145.52,105.35 149.42,-5.18
MISO  (via drill 0.35)
  Top 0.508: v81.11,53.79 78.07,50.74 v78.07,44.9 | v78.83,42.87 77.51,42.87 U3.16
  Bottom 0.508: ISP.1 89.24,41.45 89.24,42.87 83.65,48.45 83.65,51.25 v81.11,53.79 | v78.07,44.9 78.83,44.14 v78.83,42.87
MOSI  (via drill 0.35)
  Top 0.305: 85.94,46.93 82.13,43.12 80.44,43.12 79.02,41.7 U3.15
  Top 0.508: OLED.8 68.17,83.25 83.15,83.25 85.94,80.46 v85.94,53.53 85.94,46.93
  Bottom 0.305: 86.45,53.53 v85.94,53.53
  Bottom 0.508: R5.1 86.45,53.53
  Bottom 0.61: ISP.4 108.29,27.63 R5.1
N$1  (via drill 0.35)
  Top 0.508: R3.2 96.71,25.78 100.85,25.78 v116.07,10.55 BUZZER.P$1
N$2
  Bottom 0.305: R5.2 110.19,33.78 LED3.A
N$3
  Bottom 0.152: 107.78,61.84 R4.1
  Bottom 0.406: LED2.A 107.78,61.84
N$4
  Top 0.305: R15.2 16.09,30.17 15.52,30.74 U4.1
N$5
  Top 0.508: R8.2 47.08,42.87 46.04,43.9 LED6.A
N$6
  Bottom 0.305: 109.75,58.81 LED2.C
  Bottom 0.406: LED2.C 109.88,59.19 113.62,62.93 115.4,62.93 115.78,62.55
  Bottom 0.508: R18.2 109.75,58.81 | 115.78,62.55 U$2.1
N$7
  Bottom 0.152: R2.2 119.58,64.24
  Bottom 0.406: 119.58,64.24 U$2.5
N$8
  Top 0.305: R16.2 18.95,26.61 17.17,28.39 14.06,28.39 12.92,29.53 U4.5
N$10
  Top 0.61: ISP.2 104.42,29.83 R7.1
N$11
  Bottom 0.305: LED4.A 107.75,56.48 R18.1
N$13
  Top 0.508: R9.2 92.94,46.13 LED7.A
N$14
  Top 0.61: U1.3 R17.1
N$20
  Top 0.305: LED1.C 21.71,17.21 22.19,17.69 22.19,22.29 21.68,22.8 17.11,22.8 16.6,23.31 16.6,25.34 16.09,25.85 12.79,25.85 12.27,25.33 U4.23
N$21
  Top 0.305: LED8.C 19.43,21.78 13.55,21.78 12.53,22.8 12.03,22.8 11.62,23.21 U4.22
N$22
  Top 0.305: LED1.A R14.1
N$23
  Top 0.305: LED8.A R1.1
PB0  (via drill 0.35)
  Top 0.305: v80.61,39.56 80.34,39.3 U3.12
  Top 0.508: OLED.4 55.32,82.63 58,79.95 81.37,79.95 82.64,78.68 82.64,47.95 80.61,45.91 v80.61,44.9
  Bottom 0.508: v80.61,44.9 v80.61,39.56
PB1
  Top 0.305: 90,48.2 83.4,41.6 81.11,41.6 79.62,40.1 U3.13
  Top 0.508: OLED.16 90,81.74 90,48.2
REDLED
  Top 0.508: R8.1 64.14,44 U3.24
RESET  (via drill 0.35)
  Top 0.305: R6.1 63.33,39.8 65.13,39.8 65.63,39.3 U3.29 | C3.2 63.33,37.2 | 37.55,20.38 RESET.4
  Top 0.508: 63.33,37.2 63.33,39.8 | R6.1 63.09,41.08 62.83,41.34 56.9,41.34 v53.17,36.34 | v39.97,22.8 37.55,20.38 | RESET.4 RESET.3
  Bottom 0.508: v53.17,36.34 53.17,33.3 51.06,31.18 | 51.06,31.18 42.68,22.8 v39.97,22.8 | 51.06,31.18 93.84,31.18 103.24,21.78 106.5,21.78 ISP.5
RXI
  Top 0.305: R16.1 28.47,33.72 64.1,33.72 65.87,35.5 65.87,37.28 66.3,37.7 U3.31
S1  (via drill 0.35)
  Top 0.305: v67.65,33.98 68.56,34.88 U3.32
  Top 0.406: 18.88,56.94 R10.2
  Top 0.61: S1.3 26.32,77.91 24.6,77.91 21.93,75.24 21.93,69.03 18.88,65.98 18.88,56.94 | R10.2 20.21,56.89 v20.92,57.6
  Bottom 0.508: v20.92,57.6 20.92,52.77 35.39,38.29 63.33,38.29 v67.65,33.98
S2  (via drill 0.35)
  Top 0.305: v67.65,32.71 68.92,32.71 70.05,33.83 U3.1
  Top 0.406: S2.3 20.15,71.63 | 12.79,62.17 12.74,62.17
  Top 0.61: 12.74,62.17 R11.2 14.63,56.9 v15.07,57.34 | 20.15,71.63 20.15,69.54 12.79,62.17
  Bottom 0.305: v15.07,57.34 15.07,57.09 | 67.4,32.71 v67.65,32.71
  Bottom 0.508: 15.07,57.09 34.89,37.28 62.83,37.28 67.4,32.71
S3  (via drill 0.35)
  Top 0.305: v70.95,32.45 70.95,35.31 U3.2
  Top 0.406: 24.73,57 R12.2
  Top 0.61: 24.73,57 24.73,58.61 28.09,61.98 S3.3 | R12.2 26.3,56.89 v27.01,57.6
  Bottom 0.305: 70.45,32.45 v70.95,32.45
  Bottom 0.508: v27.01,57.6 27.01,47.95 35.65,39.31 63.59,39.31 70.45,32.45
S4  (via drill 0.35)
  Top 0.305: 77.31,38.34 77.2,38.44 | 77.2,38.44 U3.11 | v80.61,38.55 77.3,38.55 77.2,38.44
  Top 0.406: R13.2 30.58,57.14
  Top 0.61: 30.58,57.14 30.58,61.67 36.09,67.19 S4.3 | R13.2 32.15,56.89 v32.85,57.6
  Bottom 0.508: v32.85,57.6 32.85,43.37 35.9,40.33 63.84,40.33 70.7,33.47 78.83,33.47 80.61,35.25 v80.61,38.55
SCK  (via drill 0.35)
  Top 0.305: 84.42,46.93 v83.78,46.3 81.48,44 U3.17
  Top 0.508: OLED.7 62.94,83.39 64.6,81.73 82.38,81.73 84.42,79.7 84.42,46.93
  Bottom 0.508: ISP.3 104.47,23.31 103.21,23.31 87.97,38.55 87.97,42.1 v83.78,46.3
SS
  Top 0.305: 87.97,47.44 82.89,42.36 80.65,42.36 79.19,40.9 U3.14
  Top 0.508: OLED.15 87.97,81.23 87.97,47.44
TXO
  Top 0.305: R15.1 25.68,34.48 63.33,34.48 64.86,36.01 64.86,37.53 65.83,38.5 U3.30
VCHARGE  (via drill 0.35)
  Top 0.406: 74.13,30.6 S5.2 74,30.47 74,32.2
  Top 0.508: v111.59,56.58 111.59,42.61 109.82,40.83 104.99,40.83 v94.07,29.91 | v86.19,29.91 86.19,32.45 85.18,33.47 75.27,33.47 74,32.2
  Bottom 0.254: BATT.1 113.79,71.19 | 119.98,60.85 C5.1
  Bottom 0.406: C5.1 118.75,60.94 116.93,59.12 114.64,59.12 113.88,59.88 U$2.3 | 113.79,71.19 116.29,71.19 121.5,65.98 123.02,65.98 123.28,65.73 123.28,59.12 123.02,58.87 120.23,58.87 119.98,59.12 119.98,60.85
  Bottom 0.508: 114.64,59.12 114.13,59.12 v111.59,56.58 | v94.07,29.91 v86.19,29.91
VLIPO  (via drill 0.35)
  Top 0.305: 77.56,58.35 D1.A
  Top 0.508: S5.1 77.49,32.45 v84.16,32.45 | v77.56,55.82 77.56,58.35
  Bottom 0.508: v84.16,32.45 84.16,43.37 82.64,44.9 82.64,50.74 v77.56,55.82
VSYS  (via drill 0.35)
  Top 0.305: 67.82,56.5 C7.1 | 74.26,54.8 74.51,55.06 | U3.6 74.05,36.72 73.75,37.02 72.73,37.02 72.45,36.74 U3.4 72.61,35.24 72.61,34.63 72.73,34.51 v72.73,32.45 | 74.85,47.02 v75.02,47.18
  Top 0.406: 73.75,37.02 73.75,39.31 74.85,40.41 U3.18
  Top 0.508: R6.2 58.49,39.8 v54.95,36.26
  Top 0.61: C8.1 C9.1 67.82,56.5 67.82,55.14 68.16,54.8 74.26,54.8 | U1.5 74.72,55.27 74.51,55.06 75.02,54.55 v75.02,47.18 | R7.2 100.42,33.21 v100.16,33.47 | U3.18 74.85,47.02
  pour Bottom: -5.09,-1.69 -5.09,111.18 146.44,111.18 146.44,-1.69
VUSB  (via drill 0.35)
  Top 0.305: USB.VBUS 10.23,12.4 v9.99,12.64 | v13.55,13.4 13.55,14.16 13.87,14.48 R14.2 R1.2 12.09,22.29 11.01,22.29 10.32,22.98 U4.20 10.32,25.85 | 10.32,25.92 10.32,25.85 | 10.32,25.85 9.05,27.12 6.18,27.12 5.68,27.63 5.68,32.71 6.44,33.47 12.79,33.47 13.04,33.21 13.57,32.69 U4.4 | R17.2 74.72,62.17 74.51,62.38 | D1.C 77.6,62.4
  Top 0.508: 77.6,62.4 R17.2 | D1.C 79.67,62.25 v79.84,62.42
  Top 0.61: U1.1 74.72,62.17 | 13.04,33.21 35.14,55.31 35.14,61.41 39.97,66.23 73.24,66.23 74.51,64.96 74.51,62.38
  Bottom 0.152: 113.85,64.2 U$2.4
  Bottom 0.305: v9.99,12.64 12.79,12.64 v13.55,13.4
  Bottom 0.508: v79.84,62.42 102.96,62.42
  Bottom 0.61: C6.1 111.62,64.94 112.36,64.2 | 112.36,64.2 113.85,64.2 | R4.2 111.36,61.94 112.36,62.93 112.36,63.44 | 112.36,63.44 112.36,64.2 | 102.96,62.42 103.97,63.44 112.36,63.44
X  (via drill 0.35)
  Top 0.305: U3.25 65.48,42.5 v65.37,42.61
  Bottom 0.508: v65.37,42.61 65.11,42.87 65.11,78.17 68.16,81.22 103.72,81.22 109.56,87.06 114.9,87.06 115.83,86.12 U$5.X
Y  (via drill 0.35)
  Top 0.305: U3.26 66.23,41.7 v66.13,41.6
  Bottom 0.305: 125.31,74.62 125.16,74.62 U$5.Y
  Bottom 0.508: v66.13,41.6 66.13,77.66 68.41,79.95 103.72,79.95 104.99,78.68 116.93,78.68 120.99,74.62 125.16,74.62

### Text on the board
bStop: Gameboy / Nick Hulsey / 4/2/2019